# Altium schematic sheet mixer.SchDoc
size A
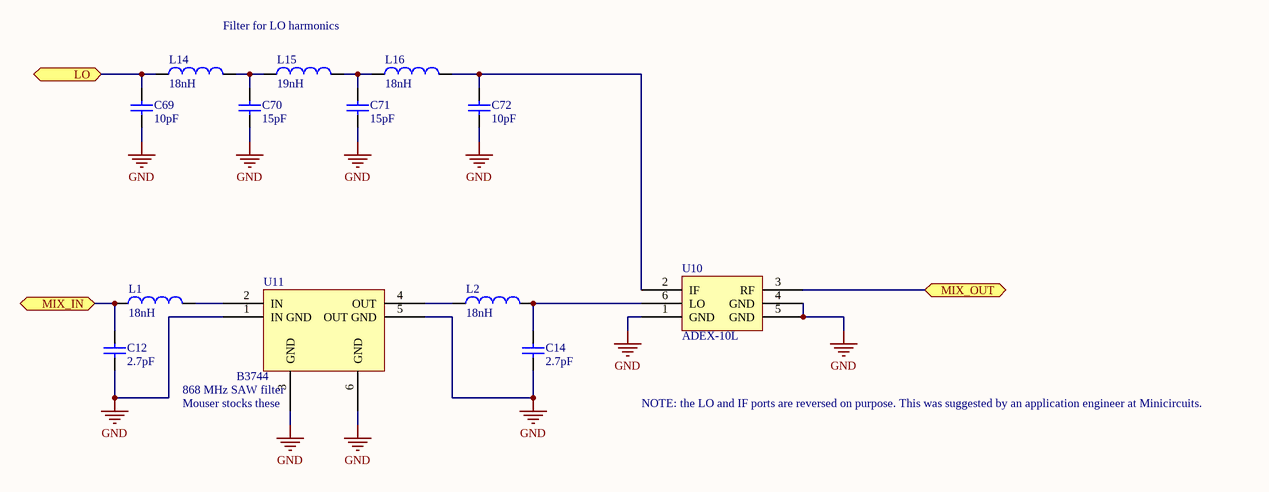
[diagram p0: mixer.SchDoc]

## Parts
C12  value 2.7pF  [0402]  (hidden comment: Cap Semi)
C14  value 2.7pF  [0402]  (hidden comment: Cap Semi)
C69  value 10pF  [0402]  (hidden comment: Cap Semi)
C70  value 15pF  [0402]  (hidden comment: Cap Semi)
C71  value 15pF  [0402]  (hidden comment: Cap Semi)
C72  value 10pF  [0402]  (hidden comment: Cap Semi)
L1  value 18nH  [0402]  (hidden comment: Inductor)
L2  value 18nH  [0402]  (hidden comment: Inductor)
L14  value 18nH  [0402]  (hidden comment: Inductor)
L15  value 19nH  [0402]  (hidden comment: Inductor)
L16  value 18nH  [0402]  (hidden comment: Inductor)
U10  ADEX-10L
U11  B3744

## Ports
LO, MIX_IN, MIX_OUT

## Nets
GND: C12.1 C14.2 C69.2 C70.2 C71.2 C72.2 U10.1(GND) U10.4(GND) U10.5(GND) U11.1(IN_GND) U11.3(GND) U11.5(OUT_GND) U11.6(GND)
LO: C69.1 L14.1 ; port LO
MIX_IN: C12.2 L1.1 ; port MIX_IN
MIX_OUT: U10.3(RF) ; port MIX_OUT
NetC14_1: C14.1 L2.2 U10.6(LO)
NetC70_1: C70.1 L14.2 L15.1
NetC71_1: C71.1 L15.2 L16.1
NetC72_1: C72.1 L16.2 U10.2(IF)
NetL1_2: L1.2 U11.2(IN)
NetL2_1: L2.1 U11.4(OUT)

## Notes on the sheet
- Filter for LO harmonics
- (near U11) 868 MHz SAW filter
- (near U11) Mouser stocks these
- NOTE: the LO and IF ports are reversed on purpose. This was suggested by an application engineer at Minicircuits.

## Library data of the parts
C12 C14 C69-C72 = Cap Semi: Capacitor (Semiconductor SIM Model); Published: 8-Jun-2000; LatestRevisionDate: 29-May-2009; LatestRevisionNote: IPC-7351 Footprint Added.; PackageReference: C1206; Publisher: Altium Limited; PackageDescription: Chip Capacitor
L1 L2 L14-L16 = Inductor: Code_IEC: 1005; Published: 8-Jun-2000; LatestRevisionDate: 29-May-2009; LatestRevisionNote: IPC-7351 Footprint Added.; PackageReference: 0402-A; Publisher: Altium Limited; PackageDescription: Chip Inductor; Code_JEITA: 0402
U10 = ADEX-10L: Passive Mixer